# EAGLE schematic Adafruit PyGamer (EAGLE 9.3.2)
COMPANY: ADAFRUIT INDUSTRIES; DRAWN: KTOWN; REV: B

## Sheet 1 of 2
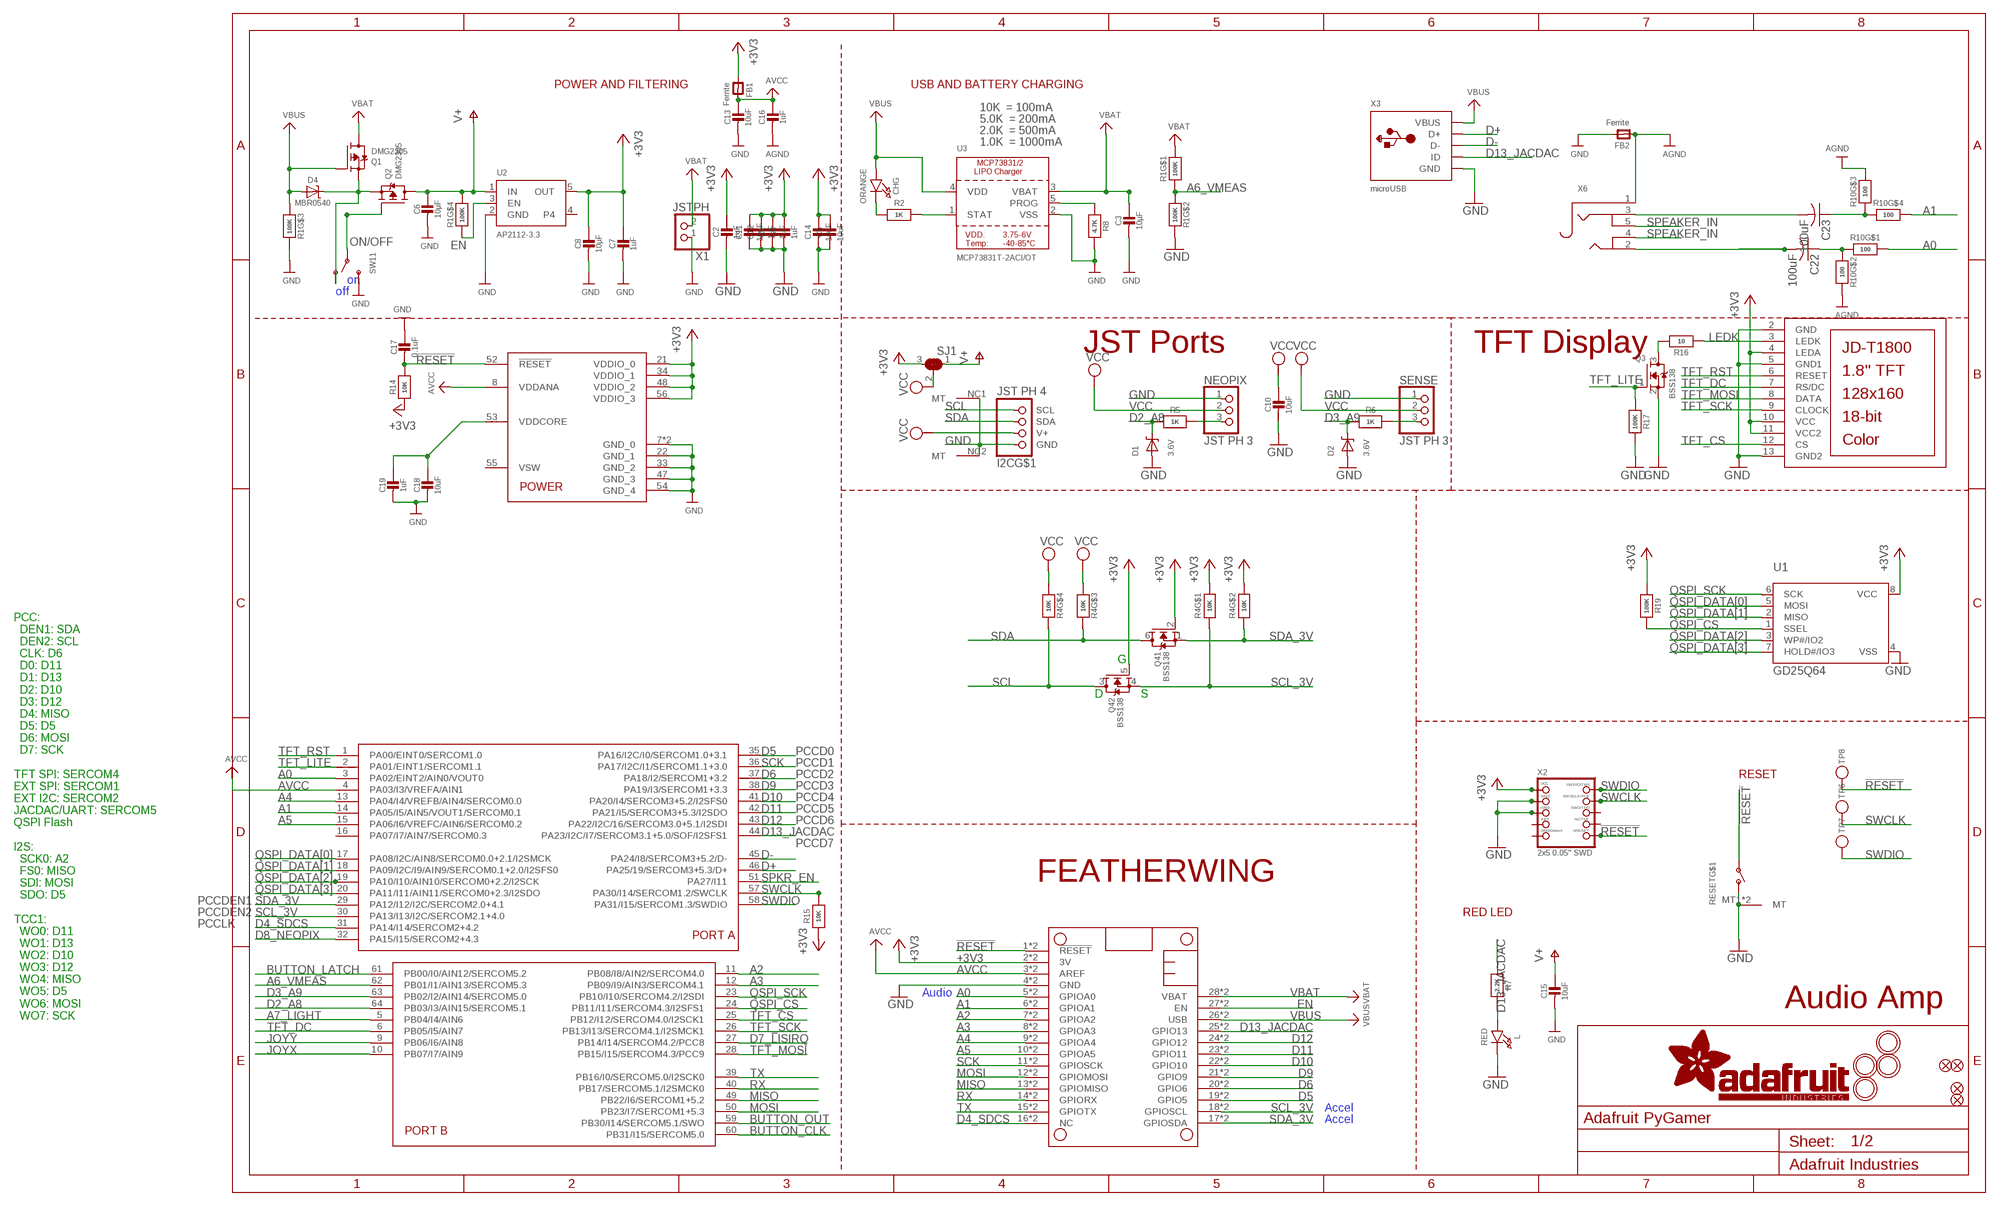
[diagram p0: schematic, sheet 1]

### Parts
C1  1uF  CAP_CERAMIC0603_NO  [0603-NO]
C2  1uF  CAP_CERAMIC0603_NO  [0603-NO]
C3  10µF  CAP_CERAMIC0805-NOOUTLINE  [0805-NO]
C4  1uF  CAP_CERAMIC0603_NO  [0603-NO]
C5  10uF  CAP_CERAMIC0805-NOOUTLINE  [0805-NO]
C6  10µF  CAP_CERAMIC0805-NOOUTLINE  [0805-NO]
C7  1uF  CAP_CERAMIC0603_NO  [0603-NO]
C8  10µF  CAP_CERAMIC0805-NOOUTLINE  [0805-NO]
C10  10uF  CAP_CERAMIC0805-NOOUTLINE  [0805-NO]
C11  10uF  CAP_CERAMIC0805-NOOUTLINE  [0805-NO]
C12  1uF  CAP_CERAMIC0603_NO  [0603-NO]
C13  10uF  CAP_CERAMIC0805-NOOUTLINE  [0805-NO]
C14  10uF  CAP_CERAMIC0805-NOOUTLINE  [0805-NO]
C15  10uF  CAP_CERAMIC0805-NOOUTLINE  [0805-NO]
C16  1uF  CAP_CERAMIC0603_NO  [0603-NO]
C17  0.1uF  CAP_CERAMIC0603_NO  [0603-NO]
C18  10uF  CAP_CERAMIC0805-NOOUTLINE  [0805-NO]
C19  1uF  CAP_CERAMIC0603_NO  [0603-NO]
C22  100uF  C-USC1210  [C1210]
C23  100uF  C-USC1210  [C1210]
CHG  ORANGE  LED0805_NOOUTLINE  [CHIPLED_0805_NOOUTLINE]
D1  3.6V  DIODE-ZENERSOD323  [SOD-323]
D2  3.6V  DIODE-ZENERSOD323  [SOD-323]
D4  MBR0540  DIODE-SCHOTTKYSOD-123  [SOD-123]
FB1  Ferrite  FERRITE-0805NO  [0805-NO]
FB2  Ferrite  FERRITE_0805MP  [_0805MP]
I2C  JST PH 4  STEMMA_I2C_RASMT  [JSTPH4]
L  RED  LED0805_NOOUTLINE  [CHIPLED_0805_NOOUTLINE]
LCD1  DISP_LCD_JDT1800  [JD-T1800]
MS1  FEATHERWING_SMTDUALNOHOLES  [FEATHERWING_SMT_NOHOLES]
NEOPIX  JST PH 3  CON_JST_PH_3PIN  [JSTPH3]
Q1  DMG2305  MOSFET-P  [SOT23-R]
Q2  DMG2305  MOSFET-P  [SOT23-R]
Q3  BSS138  MOSFET-NWIDE  [SOT23-WIDE]
Q4  BSS138  MOSFET-N_DUAL  [SOT363]
R1  100K  RESISTOR_4PACK  [RESPACK_4X0603]
R2  1K  RESISTOR_0603_NOOUT  [0603-NO]
R4  10K  RESISTOR_4PACK  [RESPACK_4X0603]
R5  1K  RESISTOR_0603_NOOUT  [0603-NO]
R6  1K  RESISTOR_0603_NOOUT  [0603-NO]
R7  2.2K  RESISTOR_0603_NOOUT  [0603-NO]
R8  4.7K  RESISTOR_0603_NOOUT  [0603-NO]
R10  100  RESISTOR_4PACK  [RESPACK_4X0603]
R14  10K  RESISTOR_0603_NOOUT  [0603-NO]
R15  10K  RESISTOR_0603_NOOUT  [0603-NO]
R16  10  RESISTOR_0603_NOOUT  [0603-NO]
R17  100K  RESISTOR_0603_NOOUT  [0603-NO]
R19  100K  RESISTOR_0603_NOOUT  [0603-NO]
RESET  SWITCH_SPST_TACT_RA  [SPST_TACTILE_RA]
SENSE  JST PH 3  CON_JST_PH_3PIN  [JSTPH3]
SJ1  SOLDERJUMPER_2WAY  [SOLDERJUMPER_2WAY_OPEN_NOPASTE]
SW11  SWITCH_SPDT  [SPDT_SMT_SSSS811101]
TP6  TESTPOINTROUND2MMNO  [TESTPOINT_ROUND_2MM_NO]
TP7  TESTPOINTROUND2MMNO  [TESTPOINT_ROUND_2MM_NO]
TP8  TESTPOINTROUND2MMNO  [TESTPOINT_ROUND_2MM_NO]
U1  GD25Q64  SPIFLASH_8PIN208MIL  [SOIC8_208MIL]
U2  AP2112-3.3  VREG_SOT23-5  [SOT23-5]
U3  MCP73831T-2ACI/OT  MCP73831/2  [SOT23-5]
U$5  MOUNTINGHOLE3.0THIN  [MOUNTINGHOLE_3.0_PLATEDTHIN]
U$6  MOUNTINGHOLE3.0THIN  [MOUNTINGHOLE_3.0_PLATEDTHIN]
U$17  MOUNTINGHOLE3.0THIN  [MOUNTINGHOLE_3.0_PLATEDTHIN]
U$18  MOUNTINGHOLE3.0THIN  [MOUNTINGHOLE_3.0_PLATEDTHIN]
U$24  ATSAMD51J19  ATSAMD51J  [PQFN64-1]
U$34  FIDUCIAL_1MM  [FIDUCIAL_1MM]
U$35  FIDUCIAL_1MM  [FIDUCIAL_1MM]
U$43  FIDUCIAL_1MM  [FIDUCIAL_1MM]
U$46  FIDUCIAL_1MM  [FIDUCIAL_1MM]
X1  JSTPH  CON_JST_PH_2PIN  [JSTPH2]
X2  2x5 0.05" SWD  JTAG-CORTEXBOXPOSTS  [2X05_1.27MM_BOX_POSTS]
X3  microUSB  USB_MICRO_20329_V2  [4UCONN_20329_V2]
X6  AUDIO_3.5MMJACK  [4UCONN_19269]

### Nets
!RESET: C17.2 MS1.1(!RESET) MS1.1B(!RESET) R14.2 RESET.1(P) TP8.P$1 U$24.52(!RESET) X2.10(NRESET)
+3V3 [power]: C1.1 C2.1 C4.1 C5.1 C7.1 C8.1 C11.1 C12.1 C14.1 FB1.1 LCD1.4(LEDA) LCD1.10(VCC) LCD1.11(VCC2) MS1.2(3V) MS1.2B(3V) Q4.2(1:G) Q4.5(2:G) R4.1 R4.2 R14.1 R15.1 R19.1 SJ1.3 U1.8(VCC) U2.5(OUT) U$24.21(VDDIO_0) U$24.34(VDDIO_1) U$24.48(VDDIO_2) U$24.56(VDDIO_3) X2.1(VCC) ; also sheet 2
A0: MS1.5(GPIOA0) MS1.5B(GPIOA0) R10.8 U$24.3(PA02/EINT2/AIN0/VOUT0)
A1: MS1.6(GPIOA1) MS1.6B(GPIOA1) R10.5 U$24.14(PA05/I5/AIN5/VOUT1/SERCOM0.1)
A2: MS1.7(GPIOA2) MS1.7B(GPIOA2) U$24.11(PB08/I8/AIN2/SERCOM4.0)
A3: MS1.8(GPIOA3) MS1.8B(GPIOA3) U$24.12(PB09/I9/AIN3/SERCOM4.1)
A4: MS1.9(GPIOA4) MS1.9B(GPIOA4) U$24.13(PA04/I4/VREFB/AIN4/SERCOM0.0)
A5: MS1.10(GPIOA5) MS1.10B(GPIOA5) U$24.15(PA06/I6/VREFC/AIN6/SERCOM0.2)
A6_VMEAS: R1.1 R1.2 U$24.62(PB01/I1/AIN13/SERCOM5.3)
A7_LIGHT: U$24.5(PB04/I4/AIN6) ; also sheet 2
AGND: C16.2 FB2.1 R10.6 R10.7 X6.1 ; also sheet 2
AVCC: C13.1 C16.1 FB1.2 MS1.3(AREF) MS1.3B(AREF) U$24.4(PA03/I3/VREFA/AIN1) U$24.8(VDDANA)
BUTTON_CLK: U$24.60(PB31/I15/SERCOM5.0) ; also sheet 2
BUTTON_LATCH: U$24.61(PB00/I0/AIN12/SERCOM5.2) ; also sheet 2
BUTTON_OUT: U$24.59(PB30/I14/SERCOM5.1/SWO) ; also sheet 2
CHG_LED: R2.2 U3.1(STAT)
CHG_RATE: R8.1 U3.5(PROG)
D2_: NEOPIX.3 R5.1
D2_A8: D1.C R5.2 U$24.64(PB03/I3/AIN15/SERCOM5.1)
D3_: R6.1 SENSE.3
D3_A9: D2.C R6.2 U$24.63(PB02/I2/AIN14/SERCOM5.0)
D4_SDCS: MS1.16(NC) MS1.16B(NC) U$24.31(PA14/I14/SERCOM2+4.2) ; also sheet 2
D5: MS1.19(GPIO5) MS1.19B(GPIO5) U$24.35(PA16/I2C/I0/SERCOM1.0+3.1)
D6: MS1.20(GPIO6) MS1.20B(GPIO6) U$24.37(PA18/I2/SERCOM1+3.2)
D7_LISIRQ: U$24.27(PB14/I14/SERCOM4.2/PCC8) ; also sheet 2
D8_NEOPIX: U$24.32(PA15/I15/SERCOM2+4.3) ; also sheet 2
D9: MS1.21(GPIO9) MS1.21B(GPIO9) U$24.38(PA19/I3/SERCOM1+3.3)
D10: MS1.22(GPIO10) MS1.22B(GPIO10) U$24.41(PA20/I4/SERCOM3+5.2/I2SFS0)
D11: MS1.23(GPIO11) MS1.23B(GPIO11) U$24.42(PA21/I5/SERCOM3+5.3/I2SDO)
D12: MS1.24(GPIO12) MS1.24B(GPIO12) U$24.43(PA22/I2C/16/SERCOM3.0+5.1/I2SDI)
D13_JACDAC: MS1.25(GPIO13) MS1.25B(GPIO13) R7.1 U$24.44(PA23/I2C/I7/SERCOM3.1+5.0/SOF/I2SFS1) X3.ID
D+: U$24.46(PA25/19/SERCOM3+5.3/D+) X3.D+
D-: U$24.45(PA24/I8/SERCOM3+5.2/D-) X3.D-
EN: MS1.27(EN) MS1.27B(EN) R1.4 U2.3(EN)
GND: C1.2 C2.2 C3.2 C4.2 C5.2 C6.2 C7.2 C8.2 C10.2 C11.2 C12.2 C13.2 C14.2 C15.2 C17.1 C18.2 C19.2 D1.A D2.A FB2.2 I2C.1(GND) I2C.NC1(MT) I2C.NC2(MT) L.C LCD1.2(GND) LCD1.5(GND1) LCD1.13(GND2) MS1.4(GND) MS1.4B(GND) NEOPIX.1 Q3.2(S) R1.6 R1.7 R8.2 R17.2 RESET.2(S) RESET.MT1(MT) RESET.MT2(MT) SENSE.1 SW11.C(S) U1.4(VSS) U2.2(GND) U3.2(VSS) U$24.7(GND_0) U$24.22(GND_1) U$24.33(GND_2) U$24.47(GND_3) U$24.54(GND_4) U$24.EXP(GND_0) X1.1 X2.3(GND) X2.5(GND) X3.BASE@1(GND) X3.BASE@2(GND) X3.GND X3.SPRT@1(GND) X3.SPRT@2(GND) X3.SPRT@3(GND) X3.SPRT@4(GND) ; also sheet 2
JOYX: U$24.10(PB07/I7/AIN9) ; also sheet 2
JOYY: U$24.9(PB06/I6/AIN8) ; also sheet 2
LEDK: LCD1.3(LEDK) R16.1
MISO: MS1.13(GPIOMISO) MS1.13B(GPIOMISO) U$24.49(PB22/I6/SERCOM1+5.2) ; also sheet 2
MOSI: MS1.12(GPIOMOSI) MS1.12B(GPIOMOSI) U$24.50(PB23/I7/SERCOM1+5.3) ; also sheet 2
N$1: CHG.C R2.1
N$2: L.A R7.2
N$6: Q3.3(D) R16.2
N$8: D4.C Q1.2(S) Q2.2(S) SW11.A(O)
N$12: C23.2 X6.3
N$14: C22.2 X6.2
N$15: C23.1 R10.3 R10.4
N$70: C22.1 R10.1 R10.2
ON/OFF: Q2.1(G) SW11.B(P)
QSPI_CS: R19.2 U1.1(SSEL) U$24.24(PB11/I11/SERCOM4.3/I2SFS1)
QSPI_DATA[0]: U1.5(MOSI) U$24.17(PA08/I2C/AIN8/SERCOM0.0+2.1/I2SMCK)
QSPI_DATA[1]: U1.2(MISO) U$24.18(PA09/I2C/I9/AIN9/SERCOM0.1+2.0/I2SFS0)
QSPI_DATA[2]: U1.3(WP#/IO2) U$24.19(PA10/I10/AIN10/SERCOM0+2.2/I2SCK)
QSPI_DATA[3]: U1.7(HOLD#/IO3) U$24.20(PA11/I11/AIN11/SERCOM0+2.3/I2SDO)
QSPI_SCK: U1.6(SCK) U$24.23(PB10/I10/SERCOM4.2/I2SDI)
RX: MS1.14(GPIORX) MS1.14B(GPIORX) U$24.40(PB17/SERCOM5.1/I2SMCK0)
SCK: MS1.11(GPIOSCK) MS1.11B(GPIOSCK) U$24.36(PA17/I2C/I1/SERCOM1.1+3.0) ; also sheet 2
SCL: I2C.4(SCL) Q4.3(2:D) R4.5
SCL_3V: MS1.18(GPIOSCL) MS1.18B(GPIOSCL) Q4.4(2:S) R4.8 U$24.30(PA13/I13/I2C/SERCOM2.1+4.0) ; also sheet 2
SDA: I2C.3(SDA) Q4.6(1:D) R4.6
SDA_3V: MS1.17(GPIOSDA) MS1.17B(GPIOSDA) Q4.1(1:S) R4.7 U$24.29(PA12/I12/I2C/SERCOM2.0+4.1) ; also sheet 2
SPEAKER_IN: X6.4 X6.5 ; also sheet 2
SPKR_EN: U$24.51(PA27/I11) ; also sheet 2
SWCLK: R15.2 TP6.P$1 U$24.57(PA30/I14/SERCOM1.2/SWCLK) X2.4(SWDCLK)
SWDIO: TP7.P$1 U$24.58(PA31/I15/SERCOM1.3/SWDIO) X2.2(SWDIO)
TFT_CS: LCD1.12(CS) U$24.25(PB12/I12/SERCOM4.0/I2SCK1)
TFT_DC: LCD1.7(RS/DC) U$24.6(PB05/I5/AIN7)
TFT_LITE: Q3.1(G) R17.1 U$24.2(PA01/EINT1/SERCOM1.1)
TFT_MOSI: LCD1.8(DATA) U$24.28(PB15/I15/SERCOM4.3/PCC9)
TFT_RST: LCD1.6(RESET) U$24.1(PA00/EINT0/SERCOM1.0)
TFT_SCK: LCD1.9(CLOCK) U$24.26(PB13/I13/SERCOM4.1/I2SMCK1)
TX: MS1.15(GPIOTX) MS1.15B(GPIOTX) U$24.39(PB16/I0/SERCOM5.0/I2SCK0)
V+ [power]: C6.1 C15.1 Q2.3(D) R1.5 SJ1.1 U2.1(IN) ; also sheet 2
VBAT [power]: C3.1 MS1.28(VBAT) MS1.28B(VBAT) Q1.3(D) R1.8 U3.3(VBAT) X1.2
VBUS: CHG.A D4.A MS1.26(USB) MS1.26B(USB) Q1.1(G) R1.3 U3.4(VDD) X3.VBUS
VCC [power]: C10.1 I2C.2(V+) NEOPIX.2 R4.3 R4.4 SENSE.2 SJ1.2
VDDCORE2: C18.1 C19.1 U$24.53(VDDCORE)
Unconnected: U2.4 U$24.16(PA07/I7/AIN7/SERCOM0.3) U$24.55(VSW) X2.6(SWO) X2.7(KEY) X2.8(TDI) X2.9(GNDDETECT)

### Notes on the sheet
- POWER AND FILTERING | USB AND BATTERY CHARGING
- 10K  = 100mA
- 5.0K  = 200mA
- 2.0K  = 500mA
- 1.0K  = 1000mA
- on
- off
- TFT Display
- JST Ports
- G
- D | S
- PCCD0
- PCCD1
- PCCD2 | RESET
- PCCD3
- PCCD4
- PCCD5
- PCCD6
- PCCD7
- FEATHERWING
- PCCDEN1
- PCCDEN2 | RED LED
- PCCLK
- Audio
- Audio Amp
- PCC:
    DEN1: SDA
    DEN2: SCL
    CLK: D6
    D0: D11
    D1: D13
    D2: D10
    D3: D12
    D4: MISO
    D5: D5
    D6: MOSI
    D7: SCK
  
  TFT SPI: SERCOM4
  EXT SPI: SERCOM1
  EXT I2C: SERCOM2
  JACDAC/UART: SERCOM5
  QSPI Flash
  
  I2S:
    SCK0: A2
    FS0: MISO
    SDI: MOSI
    SDO: D5
  
  TCC1:
    WO0: D11
    WO1: D13
    WO2: D10
    WO3: D12
    WO4: MISO
    WO5: D5
    WO6: MOSI
    WO7: SCK
- Accel
- Accel

## Sheet 2 of 2
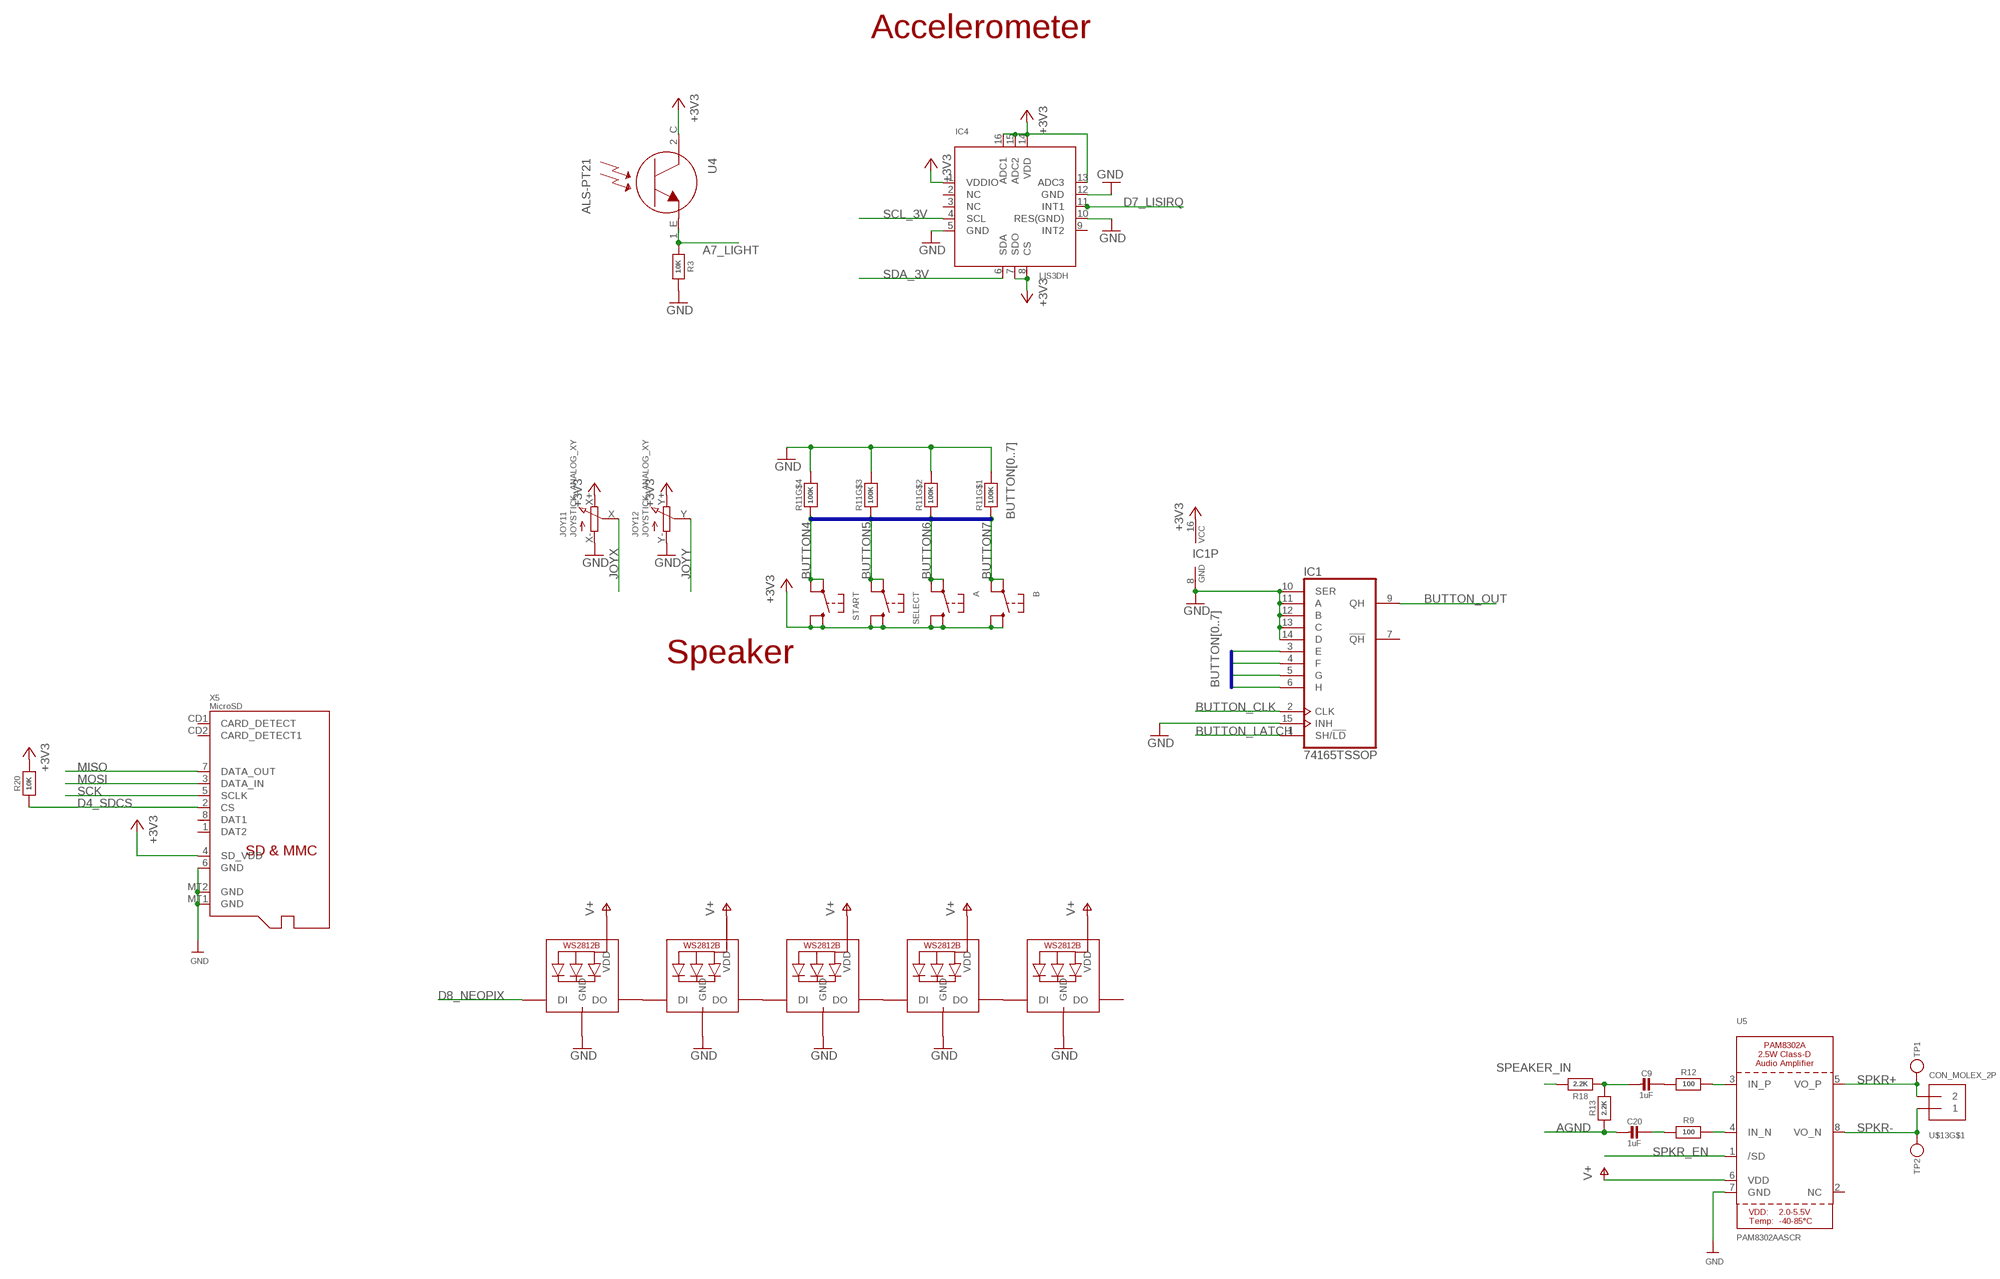
[diagram p1: schematic, sheet 2]

### Parts
A  SWITCH_TACT_SMT_6MM8MMCAP  [6MM_SMT_6MMCAP]
B  SWITCH_TACT_SMT_6MM8MMCAP  [6MM_SMT_6MMCAP]
C9  1uF  CAP_CERAMIC0603_NO  [0603-NO]
C20  1uF  CAP_CERAMIC0603_NO  [0603-NO]
IC1  74165TSSOP  [TSSOP16]
IC4  LIS3DH  ACCEL_LIS3DHTR  [LGA16_3X3MM]
JOY1  JOYSTICK_ANALOG_XY  [JOYSTICK_ANALOG_MINITHM]
LED1  WS2812B3535  [LED3535]
LED2  WS2812B3535  [LED3535]
LED3  WS2812B3535  [LED3535]
LED4  WS2812B3535  [LED3535]
LED5  WS2812B3535  [LED3535]
R3  10K  RESISTOR_0603_NOOUT  [0603-NO]
R9  100  RESISTOR_0603_NOOUT  [0603-NO]
R11  100K  RESISTOR_4PACK  [RESPACK_4X0603]
R12  100  RESISTOR_0603_NOOUT  [0603-NO]
R13  2.2K  RESISTOR_0603_NOOUT  [0603-NO]
R18  2.2K  RESISTOR_0603_NOOUT  [0603-NO]
R20  10K  RESISTOR_0603_NOOUT  [0603-NO]
SELECT  SWITCH_TACT_SMT_6MM8MMCAP  [6MM_SMT_6MMCAP]
START  SWITCH_TACT_SMT_6MM8MMCAP  [6MM_SMT_6MMCAP]
TP1  TESTPOINTROUND1.5MMNO  [TESTPOINT_ROUND_1.5MM_NO]
TP2  TESTPOINTROUND1.5MMNO  [TESTPOINT_ROUND_1.5MM_NO]
U4  ALS-PT21  PHOTOTRANSISTOR_PT26-21C  [ALS-PT26-21C]
U5  PAM8302AASCR  AUDIOAMP_PAM8302A  [MSOP8_0.65MM]
U$13  CON_MOLEX_2P  [53398-0271]
X5  MicroSD  MICROSD  [MICROSD]

### Nets
+3V3 [power]: A.B'(S1) A.B(S) B.B'(S1) B.B(S) IC1.16(VCC) IC4.1(VDDIO) IC4.7(SDO) IC4.8(CS) IC4.13(ADC3) IC4.14(VDD) IC4.15(ADC2) IC4.16(ADC1) JOY1.X+(1:E) JOY1.Y+(2:E) R20.2 SELECT.B'(S1) SELECT.B(S) START.B'(S1) START.B(S) U4.2_C(C) X5.4(SD_VDD) ; also sheet 1
A7_LIGHT: R3.2 U4.1_E(E) ; also sheet 1
AGND: C20.2 R13.1 ; also sheet 1
BUTTON4: IC1.3(E) R11.4 START.A'(P1) START.A(P)
BUTTON5: IC1.4(F) R11.3 SELECT.A'(P1) SELECT.A(P)
BUTTON6: A.A'(P1) A.A(P) IC1.5(G) R11.2
BUTTON7: B.A'(P1) B.A(P) IC1.6(H) R11.1
BUTTON_CLK: IC1.2(CLK) ; also sheet 1
BUTTON_LATCH: IC1.1(SH/!LD) ; also sheet 1
BUTTON_OUT: IC1.9(QH) ; also sheet 1
D4_SDCS: R20.1 X5.2(CS) ; also sheet 1
D7_LISIRQ: IC4.11(INT1) ; also sheet 1
D8_NEOPIX: LED1.1(DI) ; also sheet 1
GND: IC1.8(GND) IC1.10(SER) IC1.11(A) IC1.12(B) IC1.13(C) IC1.14(D) IC1.15(INH) IC4.5(GND) IC4.10(RES(GND)) IC4.12(GND) JOY1.X-(1:A) JOY1.Y-(2:A) LED1.4(GND) LED2.4(GND) LED3.4(GND) LED4.4(GND) LED5.4(GND) R3.1 R11.5 R11.6 R11.7 R11.8 U5.7(GND) X5.6(GND) X5.MT1(GND) X5.MT2(GND) ; also sheet 1
JOYX: JOY1.X(1:S) ; also sheet 1
JOYY: JOY1.Y(2:S) ; also sheet 1
MISO: X5.7(DATA_OUT) ; also sheet 1
MOSI: X5.3(DATA_IN) ; also sheet 1
N$3: LED1.3(DO) LED2.1(DI)
N$4: LED2.3(DO) LED3.1(DI)
N$5: LED3.3(DO) LED4.1(DI)
N$7: LED4.3(DO) LED5.1(DI)
N$9: R9.2 U5.4(IN_N)
N$10: R12.2 U5.3(IN_P)
N$13: C9.2 R13.2 R18.1
N$16: C20.1 R9.1
N$17: C9.1 R12.1
SCK: X5.5(SCLK) ; also sheet 1
SCL_3V: IC4.4(SCL) ; also sheet 1
SDA_3V: IC4.6(SDA) ; also sheet 1
SPEAKER_IN: R18.2 ; also sheet 1
SPKR+: TP1.P$1 U5.5(VO_P) U$13.2
SPKR-: TP2.P$1 U5.8(VO_N) U$13.1
SPKR_EN: U5.1(/SD) ; also sheet 1
V+ [power]: LED1.2(VDD) LED2.2(VDD) LED3.2(VDD) LED4.2(VDD) LED5.2(VDD) U5.6(VDD) ; also sheet 1
Unconnected: IC1.7(!QH) IC4.2(NC) IC4.3(NC) IC4.9(INT2) LED5.3(DO) U5.2(NC) U$13.M1(MT) U$13.M2(MT) X5.1(DAT2) X5.8(DAT1) X5.CD1(CARD_DETECT) X5.CD2(CARD_DETECT1)

### Buses
BUTTON[0..7]

### Notes on the sheet
- Accelerometer
- Speaker

## Library data of the parts
A B SELECT START = microbuilder:SWITCH_TACT_SMT: SMT Tact Switches 6x6mm - Digikey: P12940SCT-ND KMR2 (4.6x2.8mm) - Digikey: 401-1426-1-ND EVQ-PQHB55 - Light Touch, 160GF (4.5x4.5mm) - Digikey: P8090SCT-ND KMT0 - KMT021 NGJ LHS (etc.) IP68/Waterproof - Digikey: CKN10289CT-ND
C1-C7 C9-C20 = microbuilder:CAP_CERAMIC: Ceramic Capacitors For new designs, use the packages preceded by an '_' character since they are more reliable: The following footprints should be used on most boards: _0402 - Standard footprint for regular board layouts _0603 - Standard footprint for regular board layouts _0805 - Standard footprint for regular board layouts _1206 - Standard footprint for regular board layouts For extremely tight-pitch boards where space is at a premium, the following 'micro-pitch' footprints can be used (smaller pads, no silkscreen outline, etc.): _0402MP - Micro-pitch footprint for very dense/compact boards _0603MP - Micro-pitch footprint for very dense/compact boards _0805MP - Micro-pitch footprint for very dense/compact boards _1206MP - Micro-pitch footprint for very dense/compact boards
C8 = microbuilder:CAP_CERAMIC: Ceramic Capacitors For new designs, use the packages preceded by an '_' character since they are more reliable: The following footprints should be used on most boards: _0402 - Standard footprint for regular board layouts _0603 - Standard footprint for regular board layouts _0805 - Standard footprint for regular board layouts _1206 - Standard footprint for regular board layouts For extremely tight-pitch boards where space is at a premium, the following 'micro-pitch' footprints can be used (smaller pads, no silkscreen outline, etc.): _0402MP - Micro-pitch footprint for very dense/compact boards _0603MP - Micro-pitch footprint for very dense/compact boards _0805MP - Micro-pitch footprint for very dense/compact boards _1206MP - Micro-pitch footprint for very dense/compact boards; REV: C
C22 C23 = resistor:C-US: CAPACITOR, American symbol
CHG L = microbuilder:LED: LED 0603 - 0603 Surface Mount Package 2mA: Green LED - Low Power (3.9mcd, 2ma, 1.7Vf) - Digikey: 475-2709-2-ND Orange LED - Low Power (9.8mcd, 2ma, 1.8Vf) - Digikey: 475-1194-2-ND Red LED - Low Power (5mcd, 2ma, 1.8Vf) - Digikey: 475-1195-2-ND Yellow LED - Low Power (7mcd, 2ma, 1.8Vf) - Digikey: 475-1196-2-ND 5mA: Blue LED - Low Power (17mcd, 5ma, 2.9Vf) - Digikey: LNJ937W8CRACT-ND 0805 - 0805 Surface Mount Package 2mA: Red LED (8.8mcd, 2mA, 1.8Vf, Clear) - Low Power [Digikey: 475-2510-1-ND] Green LED (5mcd, 2mA, 1.8Vf, Clear) - Low Power [Digikey: 475-2730-1-ND] Yellow LED (11.3mcd, 2mA, 1.8Vf, Clear) - Low Power [Digikey: 475-2555-1-ND] 20mA: Red LED (104mcd, 20mA, Diffused) - LS R976 [Digikey: 475-1278-6-ND] Red LED (12mcd, 20mA, 2.0Vf, Clear) - APT2012EC [Digikey: 754-1128-1-ND] Green LED (15mcd, 20mA, 2.2Vf, Clear) - APT2012GC [Digikey: 754-1131-1-ND] Orange LED (160mcd, 20mA, 2.1Vf, Clear) - APT2012SECK [Digikey: 754-1130-1-ND] 1206 - 1206 Surface Mount Package Green LED (26mcd, 20mA, Diffused) - LG N971 [Digikey: 475-1407-6-ND] Red LED (15mcd, 20mA, Diffused) - LH N974 [Digikey: 475-1416-6-ND] Cree - Cree High-Power Surface Mount LEDs XPEBWT-L1-0000-00D50 - White 111lm 350mA 2.9Vf 6200K 110° XTEAWT-00-0000-00000LEE3 - White 114lm 350mA 2.85Vf 5000K 115° Everlight - Everlight 45-21 Series Surface Mount LEDs 45-21/QK2C-B2832AC2CB2/2T - Warm White 2000mcd 20mA 3.25Vf 3050K 120° 45-21/LK2C-B38452C4CB2/2T - Nuetral White 2000mcd 20mA 3.25Vf 4150K 120° 45-21/LK2C-B50634C6CB2/2T - Cold White 2200mcd 20mA 3.25Vf 5650K 120° PLCC2 Reverse Mount LS T77K-J1L2-1-0-2-R18-Z - Red 11.25mcd 2mA 1.8Vf 630nm 120° LO T77K-L1M2-24-Z - Orange 19.6mcd 2mA 1.8Vf 606nm 120° LY T77K-K2M1-26-Z - Yellow 15.7mcd 2mA 1.8Vf 587nm 120°
D1 D2 = microbuilder:DIODE-ZENER: Zener Diode SMA: 30V 1W Zener Diode, 1.2Vf - Digikey: SMAZ30-FDICT-ND
D4 = microbuilder:DIODE-SCHOTTKY
FB1 FB2 = microbuilder:FERRITE: Ferrite Bead 0603 MMZ1608B121C - 120 Ohm @ 100MHz, 600mA, 0.15 Ohm DC Resistance - Digikey: 445-2164-1-ND BK1608HW121-T - 120 Ohm, 600mA Ferrite Chip - Digikey: 587-1876-2-ND 0805 HZ0805B272R-10 - 2.7K Ohm @ 100MHz, 200mA, 0.8 Ohm DC Resistance - Digikey: 240-2504-1-ND (see also Murata BLM21BD272SN1L) MMZ2012Y152B - 1.5K Ohm @ 100MHz, 500mA, 0.4 Ohm DC Resistance - Digikey: 445-1560-1-ND - Mainly for high frequency (80-400MHz) MMZ2012R102A - 1K Ohm @ 100MHz, 500mA, 0.3 Ohm DC Resistance - Digikey: 445-1555-2-ND - More general purpose (10-200MHz)
I2C = microbuilder:STEMMA_I2C
IC1 = microbuilder:74*165: 8-bit parallel load SHIFT REGISTER
IC4 = microbuilder:ACCEL_LIS3DHTR: LIS3DHTR 3-Axis Accelerometer with I2C/SPI Interface VDD: 1.71-3.6V VDDIO: 1.71-VDD+0.1V Scale: +/-2g, 4g, 8g, 16g with 16--bit data output Temp:: -40°C - 85°C Mouser: 511-LIS3DHTR Digikey: 497-10613-1-ND
JOY1 = microbuilder:JOYSTICK_ANALOG_XY
LCD1 = microbuilder:DISP_LCD_JDT1800
LED1-LED5 = microbuilder:WS2812B
MS1 = microbuilder:FEATHERWING
NEOPIX SENSE = microbuilder:CON_JST_PH_3PIN
Q1 Q2 = microbuilder:MOSFET-P: P-Channel Mosfet LEGEND VDS: Voltage Drain-Source ID: Drain Current RDS(ON): Drain-Source On-State Resistance VGS(TH): Gate-Source Threshold Voltage CISS: Drain-Source Input Capacitance SOT-23 Name VDS ID RDS(ON) VGS(TH) CISS Order Number IRLML5103 30V 760mA 600 mOhm -- 75pF @ 25V Digikey: IRLML5103PBFCT-ND IRLML6401 12V 4.3A 50 mOhm 950mV @ 250µA 830pF @ 10V Digikey: IRLML6401PBFTR-ND NTR0202PL 20V 400mA 800 mOhm 2.3V @ 250uA 70pF @ 5V Digikey: NTR0202PLT1GOSTR-ND NTR4101PT1G 20V 1.8A 85 mOhm 1.2V @ 250uA 675pF @ 10V Digikey: NTR4101PT1GOSCT-ND DMP2004K 20V 600mA 900 mOhm 1V @ 250uA 175pF @ 16V Digikey: DMP2004KDICT-ND PMV65XP 20V 3.9A 76 mOhm 950mV @ 1mA 725pF @ 20V Digikey: 568-2358-2-ND TO-252 Name VDS ID RDS(ON) VGS(TH) CISS Order Number AOD417 30V 25A 34 mOhm 3V @ 250µA 920pF @ 15V Digikey: 785-1106-2-ND PowerPak Name VDS ID RDS(ON) VGS(TH) CISS Order Number AON7401 30V 12A 14 mOhm 3V @ 250µA 2600pF @ 15V Digikey: 785-1302-1-ND
Q3 = microbuilder:MOSFET-N: N-Channel Mosfet LEGEND VDS: Voltage Drain-Source ID: Drain Current RDS(ON): Drain-Source On-State Resistance VGS(TH): Gate-Source Threshold Voltage CISS: Drain-Source Input Capacitance SOT-23 Name VDS ID RDS(ON) VGS(TH) CISS Order Number 2N7002E 60V 260mA 2.5 Ohm 2.5V @ 250uA 26.7pF @ 25V 2N7002ET1GOSTR-ND BSH103 30V 850mA 400 mOhm 400mV @ 1mA 83pF @ 24V BSH103,235-ND BSS138 60V 320mA 1.6 Ohm 1.5V @ 250uA 50pF @ 10V Mouser: 771-BSS138PW115 DMN2075U-7 20V 4.2A 38 mOhm 1V @ 250 uA 594.3pF @ 10V DMN2075U-7DICT-ND * BSS138 good choice for I2C level-shifting POWERPAK 1212-8 Name VDS ID RDS(ON) VGS(TH) CISS Order Number Si7308DN 60V 6A 58 mOhm 3V @ 250uA 665pF @ 15V SI7308DN-T1-E3CT-ND
Q4 = microbuilder:MOSFET-N_DUAL: Dual N-Channel MOSFET SOT363 (2.0x1.25mm) 2N7002PS - 60V, 320mA [Digikey: 568-5984-1-ND]
R1 R4 R10 R11 = microbuilder:RESISTOR_4PACK: Resistor Packs (4 resistors) 4 x 0603 10K 1/16W - Digikey: YC164J-10KCT-ND
R2 R3 R5-R9 R12-R20 = microbuilder:RESISTOR: Resistors For new designs, use the packages preceded by an '_' character since they are more reliable: The following footprints should be used on most boards: _0402 - Standard footprint for regular board layouts _0603 - Standard footprint for regular board layouts _0805 - Standard footprint for regular board layouts _1206 - Standard footprint for regular board layouts For extremely tight-pitch boards where space is at a premium, the following 'micro-pitch' footprints can be used (smaller pads, no silkscreen outline, etc.): _0402MP - Micro-pitch footprint for very dense/compact boards _0603MP - Micro-pitch footprint for very dense/compact boards _0805MP - Micro-pitch footprint for very dense/compact boards _1206MP - Micro-pitch footprint for very dense/compact boards
RESET = microbuilder:SWITCH_SPST: Switch - SPST 4UCon 19192 (6.7x2.6mm SMT)
SJ1 = microbuilder:SOLDERJUMPER_2WAY: 2-Way Solder Jumper
SW11 = microbuilder:SWITCH_SPDT: Switch - SPDT SSSS811101 - Horizontal Two Position SMT, 0.3A 4V [Mouser: 688-SSSS811101]
TP1 TP2 TP6-TP8 = microbuilder:TESTPOINT: Test Point Various test points for characterisation and PCB testing TESTPOINT_SMT - Compact Surface Mount Test Point [Digikey: 5016KTR-ND]
U1 = microbuilder:SPIFLASH_8PIN: SOIC8 SPI Flash Be careful with the size since SOIC8 flash comes in several 'widths' SOIC8 150 mil M25P16 - 16Mbit (2Mbit x 8) Serial Flash (75MHz SPI Bus), Supply: 2.7-3.6V Digikey: SOIC8 - M25P16-VMN6P-ND SOIC8 208 mil W25Q16BVSSIG - 16Mbit (2Mbit x 8) Serial Flash (104MHz SPI Bus), Supply: 2.7-3.6V Digikey: SOIC8 - W25Q16BVSSIG-ND
U2 = microbuilder:VREG_SOT23-5: SOT23-5 Fixed Voltage Regulators Part Current Out V Out V In V Dropout θJA (°C/W) TJ (°C) Digikey Part No. ADP121 150mA 3.3V 3.4-5.5V 0.09V @ 150mA -- -- ADP121-AUJZ33R7CT-ND ADP121 150mA 3.0V 3.1-5.5V 0.09V @ 150mA -- -- ADP121-AUJZ30R7CT-ND ADP122 300mA 3.3V 3.4-5.5V 0.085V @ 300mA -- -- ADP122AUJZ-3.3-R7CT-ND ADP1712 300mA 3.3V 3.5-5.5V 0.17V @ 300mA -- -- ADP1712AUJZ-3.3-R7TR-ND AP7311 (Low Cost) 150mA 3.3V 3.5-6V 0.15V @ 150mA -- -- AP7311-33WG-7DICT-ND LD39015M18R 150mA 1.8V 1.9V-5.5V 0.08V @ 100mA -- -- 497-6977-1-ND LP2985A-33DBVR 150mA 3.3V 3.3-16V 0.28V @ 150mA 206 150 296-18479-1-ND MCP1824T-3302E/OT 300mA 3.3V 3.5V-6V 0.2V @ 300mA -- -- MCP1824T-3302E/OTCT-ND MIC5205-2.5YM5 TR 150mA 2.5V 2.7-16V 0.165V @ 150mA -- -- 576-1257-2-ND MIC5205-3.0YM5 TR 150mA 3.0V 3.2V-16V 0.165V @ 150mA -- -- 576-1258-2-ND MIC5205-3.3YM5 TR 150mA 3.3V 3.5V-16V 0.165V @ 150mA -- -- 576-1259-2-ND TPS780330220 150mA 3.3V+2.2V 3.6-5.5V 250mV Max -- -- 296-23332-1-ND TDA3663/N1,135 100mA 3.3V 3.5-45V 0.18V @ 50mA -- -- 568-5343-1-ND Max operating temp can be calculated using θJA, TJ (max junction temperature), and power in watts. Set the "Maximum Ambient Temperature" until it reaches TJ ("Max Junction Temperature"), which is the absolute limit for safe use of the regulator: Heat Sink Temperature Calculator <http://www.daycounter.com/Calculators/Heat-Sink-Temperature-Calculator.phtml> For example, With 12V source into a 3.3V LP2985 and a 30mA load, we are dissipating (12V-3.3V) * 0.03A = 0.261W. With a θJA of 206 °C/W, a TJ of 150°C, and 261mW we can safely use the chip without a heat sink up to 75°C (=147.1°C Junction Temperature).
U3 = microbuilder:MCP73831/2: MCP73831/2 LIPO Charger VDD: 3.75 - 6V Temp -40 - 85°C Programmable Charge Rate: 15-500mA NOTE: STAT is a tri-state logic output on the MCP73831 and an open-drain output on the MCP73832. SOT23-5 with 4.2V output and tri-state logic on STAT = MCP73831T-2ACI/OT
U4 = microbuilder:PHOTOTRANSISTOR: ALS-PT19-315C - Analog Light Sensor VCC: 2.5-5.5V
U5 = microbuilder:AUDIOAMP_PAM8302A: PAM8302A - 2.5W Class-D Mono Audio Amplifier MSOP8 = PAM8302AASCR
U$5 U$6 U$17 U$18 = microbuilder:MOUNTINGHOLE: Mounting Hole For #2 screws (0.086"/2.18mm width, 0.094"/2.4mm hole) use 2.5mm; BOM: EXCLUDE
U$13 = microbuilder:CON_MOLEX_2P
U$24 = microbuilder:ATSAMD51J: ATSAMD51J cortex m4 microcontroller
U$34 U$35 U$43 U$46 = microbuilder:FIDUCIAL: Fiducial Alignment Points Various fiducial points for machine vision alignment.; BOM: EXCLUDE
X1 = microbuilder:CON_JST_PH_2PIN: JST 2-Pin Right-Angle Connector PH-Series - 4UConnector: 17311 SH-Series - 4UConnector: 07278
X2 = microbuilder:JTAG-CORTEX: Serial Wire (SW-DP) Connector Standard 0.05" 10-pin connector is for use with the Cortex M and Cortex A SWD (serial wire debugger) interface (SW-DP) Connectors 2x05_1.27MM_SMT - Inexpensive surface-mount header with bare pins, compatible with standard 10-pin SWD cables (4UCON: 16846) 2x05_1.27MM_BOX_NOPOSTS - Polarised surface-mount box (4UCON with caps: 19735, without caps: 15117 2x05_1.27MM_BOX_POSTS - Polarised surface-mount box with mounting holes (4UCON: 20317) Pinout: http://infocenter.arm.com/help/topic/com.arm.doc.faqs/attached/13634/cortex_debug_connectors.pdf http://www.keil.com/peripherals/coresight/connectors.asp
X3 = microbuilder:USB: USB Connectors USBMINIB - Surface Mount Female Mini-B USB Connector 4UConnector: 06564
X5 = microbuilder:MICROSD: MicroSD/Transflash Card Holder with SPI pinout 3M: 2908-05WB-MG 4UConnector: 19656 Footprint courtesy: Adafruit Industries
X6 = microbuilder:AUDIO_3.5MMJACK: 3.5MM Audio Jack These are normally connected as follows, from left-to right on the schematic symbol above: Tip: Left Audio Inner Ring: Right Audio Shell: Common/GND

## Net classes
1 power: width 0.305 mm
2 gnd: width 0.254 mm